# EAGLE schematic SchematTesteraUsart (EAGLE 9.6.2)
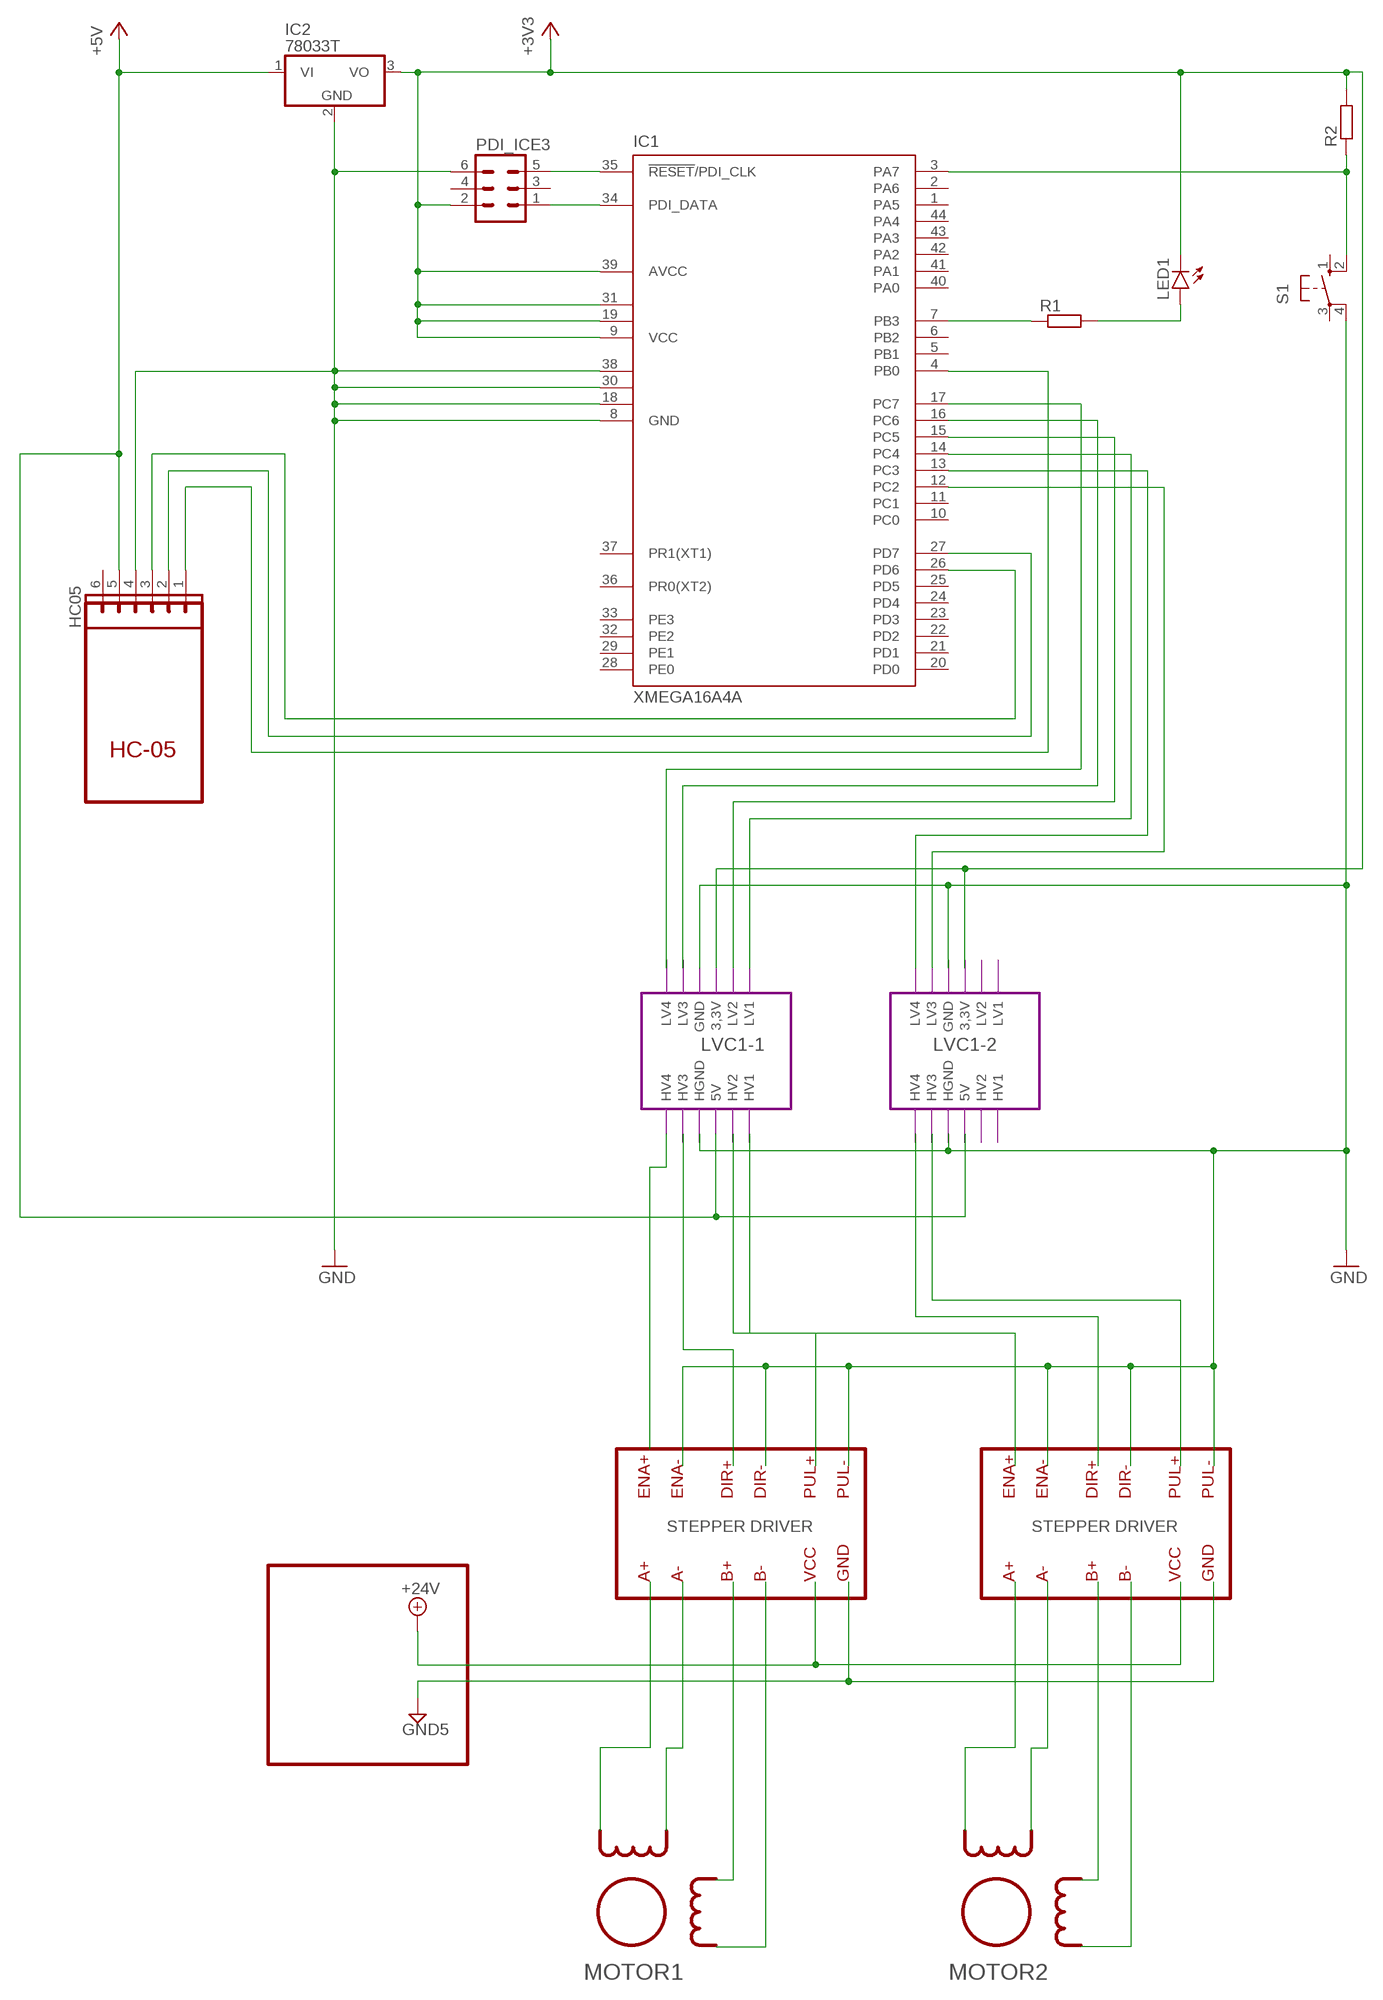
[diagram p0: schematic, sheet 1]

## Parts
HC05  MA06-1  [MA06-1]
IC1  XMEGA16A4A  [TQFP44]
IC2  78033T  7805T  [TO220H]
LED1  LED5MM  [LED5MM]
PDI_ICE3  MA03-2  [MA03-2]
R1  R-EU_0204/7  [0204/7]
R2  R-EU_0204/7  [0204/7]
S1  10-XX  [B3F-10XX]

## Module instances
LVC1-1 = LVC1
LVC1-2 = LVC1

## Nets
3V: IC1.9(VCC) IC1.19(VCC1) IC1.31(VCC2) IC1.39(AVCC) IC2.3(VO) LED1.K(C) PDI_ICE3.2 R2.2 ; supply symbol labelled +3V3
+5V: HC05.5 IC2.1(VI)
GND: HC05.4 IC1.8(GND) IC1.18(GND1) IC1.30(GND2) IC1.38(GND3) IC2.2(GND) PDI_ICE3.6 S1.4(P1)
M1_DIR: IC1.16(PC6)
M1_ENA: IC1.17(PC7)
M1_PUL: IC1.15(PC5)
M2_DIR: IC1.13(PC3)
M2_ENA: IC1.14(PC4)
M2_PUL: IC1.12(PC2)
N$1: LED1.A R1.2
N$2: IC1.35(!RESET!/PDI_CLK) PDI_ICE3.5
N$3: IC1.34(PDI_DATA) PDI_ICE3.1
N$4: IC1.7(PB3) R1.1
N$5: IC1.3(PA7) R2.1 S1.2(S1)
RX: HC05.2 IC1.27(PD7)
STATE: HC05.1 IC1.4(PB0)
TX: HC05.3 IC1.26(PD6)
Unconnected: HC05.6 IC1.1(PA5) IC1.2(PA6) IC1.5(PB1) IC1.6(PB2) IC1.10(PC0) IC1.11(PC1) IC1.20(PD0) IC1.21(PD1) IC1.22(PD2) IC1.23(PD3) IC1.24(PD4) IC1.25(PD5) IC1.28(PE0) IC1.29(PE1) IC1.32(PE2) IC1.33(PE3) IC1.36(PR0(XT2)) IC1.37(PR1(XT1)) IC1.40(PA0) IC1.41(PA1) IC1.42(PA2) IC1.43(PA3) IC1.44(PA4) PDI_ICE3.3 PDI_ICE3.4 S1.1(S) S1.3(P)

## Notes on the sheet
- HC-05
- ENA+ | ENA- | DIR+ | DIR- | PUL+ | PUL- | ENA+ | ENA- | DIR+ | DIR- | PUL+ | PUL-
- STEPPER DRIVER | STEPPER DRIVER
- A+ | A- | B+ | B- | VCC | GND | A+ | A- | B+ | B- | VCC | GND
- MOTOR1 | MOTOR2

## Library data of the parts
HC05 = con-lstb:MA06-1: PIN HEADER; OC_FARNELL: unknown; OC_NEWARK: unknown
IC1 = atmel:XMEGA16A4: MICROCONTROLLER Features High-performance, Low-power 8/16-bit AVR XMEGA Microcontroller Non-Volatile Program and Data Memories - 16 KB - 128 KB of In-System Self-Programmable Flash - 4 KB - 8 KB Boot Code Section with Independent Lock Bits - 1 KB - 2 KB EEPROM - 2 KB - 8 KB Internal SRAM Peripheral Features - Four-channel DMA Controller with support for external requests - Eight-channel Event System - Five 16-bit Timer/Counters Three Timer/Counters with 4 Output Compare or Input Capture channels Two Timer/Counters with 2 Output Compare or Input Capture channels High-Resolution Extensions on all Timer/Counters Advanced Waveform Extension on one Timer/Counter - Five USARTs IrDA Extension on one USART - Two Two-Wire Interfaces with dual address match (I2C and SMBus compatible) - Two SPIs (Serial Peripheral Interfaces) peripherals - AES and DES Crypto Engine - 16-bit Real Time Counter with Separate Oscillator - One Twelve-channel, 12-bit, 2 Msps Analog to Digital Converter - One Two-channel, 12-bit, 1 Msps Digital to Analog Converter - Two Analog Comparators with Window compare function - External Interrupts on all General Purpose I/O pins - Programmable Watchdog Timer with Separate On-chip Ultra Low Power Oscillator Special Microcontroller Features - Power-on Reset and Programmable Brown-out Detection - Internal and External Clock Options with PLL - Programmable Multi-level Interrupt Controller - Sleep Modes: Idle, Power-down, Standby, Power-save, Extended Standby - Advanced Programming, Test and Debugging Interfaces PDI (Program and Debug Interface) for programming, test and debugging I/O and Packages - 34 Programmable I/O Lines - 44 - lead TQFP - 44 - pad VQFN/QFN - 49 - ball VFBGA Operating Voltage - 1.6 - 3.6V Speed performance - 0 - 12 MHz @ 1.6 - 3.6V - 0 - 32 MHz @ 2.7 - 3.6V Drawn by Dipl.-Ing. (FH) Robert Siegler Created: 27.05.09; OC_FARNELL: unknown; OC_NEWARK: unknown
IC2 = linear:78*: Positive VOLTAGE REGULATOR Source: http://cache.national.com/ds/LM/LM78L05.pdf http://www.fairchildsemi.com/ds/LM/LM7805.pdf
LED1 = led:LED: LED OSRAM: - CHIPLED LG R971, LG N971, LY N971, LG Q971, LY Q971, LO R971, LY R971 LH N974, LH R974 LS Q976, LO Q976, LY Q976 LO Q996 - Hyper CHIPLED LW Q18S LB Q993, LB Q99A, LB R99A - SideLED LS A670, LO A670, LY A670, LG A670, LP A670 LB A673, LV A673, LT A673, LW A673 LH A674 LY A675 LS A676, LA A676, LO A676, LY A676, LW A676 LS A679, LY A679, LG A679 - Hyper Micro SIDELED® LS Y876, LA Y876, LO Y876, LY Y876 LT Y87S - SmartLED LW L88C, LW L88S LB L89C, LB L89S, LG L890 LS L89K, LO L89K, LY L89K LS L896, LA L896, LO L896, LY L896 - TOPLED LS T670, LO T670, LY T670, LG T670, LP T670 LSG T670, LSP T670, LSY T670, LOP T670, LYG T670 LG T671, LOG T671, LSG T671 LB T673, LV T673, LT T673, LW T673 LH T674 LS T676, LA T676, LO T676, LY T676, LB T676, LH T676, LSB T676, LW T676 LB T67C, LV T67C, LT T67C, LS T67K, LO T67K, LY T67K, LW E67C LS E67B, LA E67B, LO E67B, LY E67B, LB E67C, LV E67C, LT E67C LW T67C LS T679, LY T679, LG T679 LS T770, LO T770, LY T770, LG T770, LP T770 LB T773, LV T773, LT T773, LW T773 LH T774 LS E675, LA E675, LY E675, LS T675 LS T776, LA T776, LO T776, LY T776, LB T776 LHGB T686 LT T68C, LB T68C - Hyper Mini TOPLED® LB M676 - Mini TOPLED Santana® LG M470 LS M47K, LO M47K, LY M47K Source: http://www.osram.convergy.de LUXEON: - LUMILED® LXK2-PW12-R00, LXK2-PW12-S00, LXK2-PW14-U00, LXK2-PW14-V00 LXK2-PM12-R00, LXK2-PM12-S00, LXK2-PM14-U00 LXK2-PE12-Q00, LXK2-PE12-R00, LXK2-PE12-S00, LXK2-PE14-T00, LXK2-PE14-U00 LXK2-PB12-K00, LXK2-PB12-L00, LXK2-PB12-M00, LXK2-PB14-N00, LXK2-PB14-P00, LXK2-PB14-Q00 LXK2-PR12-L00, LXK2-PR12-M00, LXK2-PR14-Q00, LXK2-PR14-R00 LXK2-PD12-Q00, LXK2-PD12-R00, LXK2-PD12-S00 LXK2-PH12-R00, LXK2-PH12-S00 LXK2-PL12-P00, LXK2-PL12-Q00, LXK2-PL12-R00 Source: www.luxeon.com KINGBRIGHT: KA-3528ASYC Source: www.kingbright.com
PDI_ICE3 = con-lstb:MA03-2: PIN HEADER; OC_FARNELL: unknown; OC_NEWARK: unknown
R1 R2 = rcl:R-EU_: RESISTOR, European symbol; SPICEPREFIX: R
S1 = switch-omron:10-XX: OMRON SWITCH; MPN: B3F-1000; OC_FARNELL: 176432; OC_NEWARK: 36M3542

## Module LVC1
Ports: LV4(io) LV3(io) GND(io) 3,3V(io) LV2(io) LV1(io) HV4(io) HV3(io) HGND(io) 5V(io) HV2(io) HV1(io)

### Library data of the parts